# Altium schematic sheet TP2.SchDoc
size A
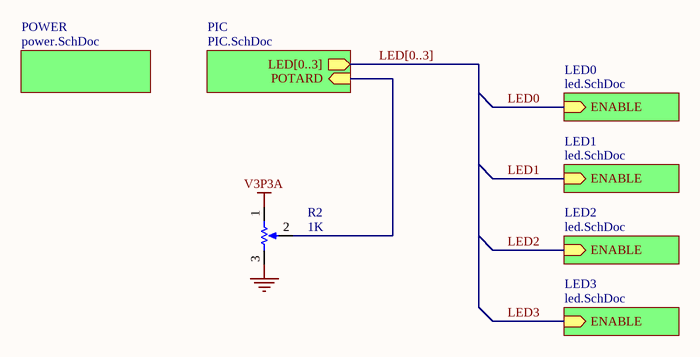
[diagram p0: TP2.SchDoc]

## Parts
R2  1K  [PDB181-K415K-102A2]

## Sub-sheets
LED0 = led.SchDoc: ENABLE
LED1 = led.SchDoc: ENABLE
LED2 = led.SchDoc: ENABLE
LED3 = led.SchDoc: ENABLE
PIC = PIC.SchDoc: LED[0..3], POTARD
POWER = power.SchDoc: no entries

## Nets
GND: R2.3(TOP)
V3P3A: R2.1(BOT)
LED0: sheet LED0/ENABLE
LED1: sheet LED1/ENABLE
LED2: sheet LED2/ENABLE
LED3: sheet LED3/ENABLE
NetR2_2: R2.2(TAP) ; sheet PIC/POTARD

## Buses and harness runs
bus LED[0..3] = sheet PIC/LED[0..3]

## Library data of the parts
R2 = RPot: Potentiometer; Sim Note: Enter the Resistance value and the set point into parameter fields.; Set Position: 0.5; Fabricant: BOURNS; Fournisseur: Farnell; RefFournisseur: 1823540; Published: 8-Jun-2000; LatestRevisionDate: 17-Jul-2002; LatestRevisionNote: Re-released for DXP Platform.; PackageReference: VR5; Publisher: Altium Limited; PackageDescription: Variable Resistor, Thru-Hole; 3 Leads; Value: 1K; RefFabricant: PDB181-K415K-102A2